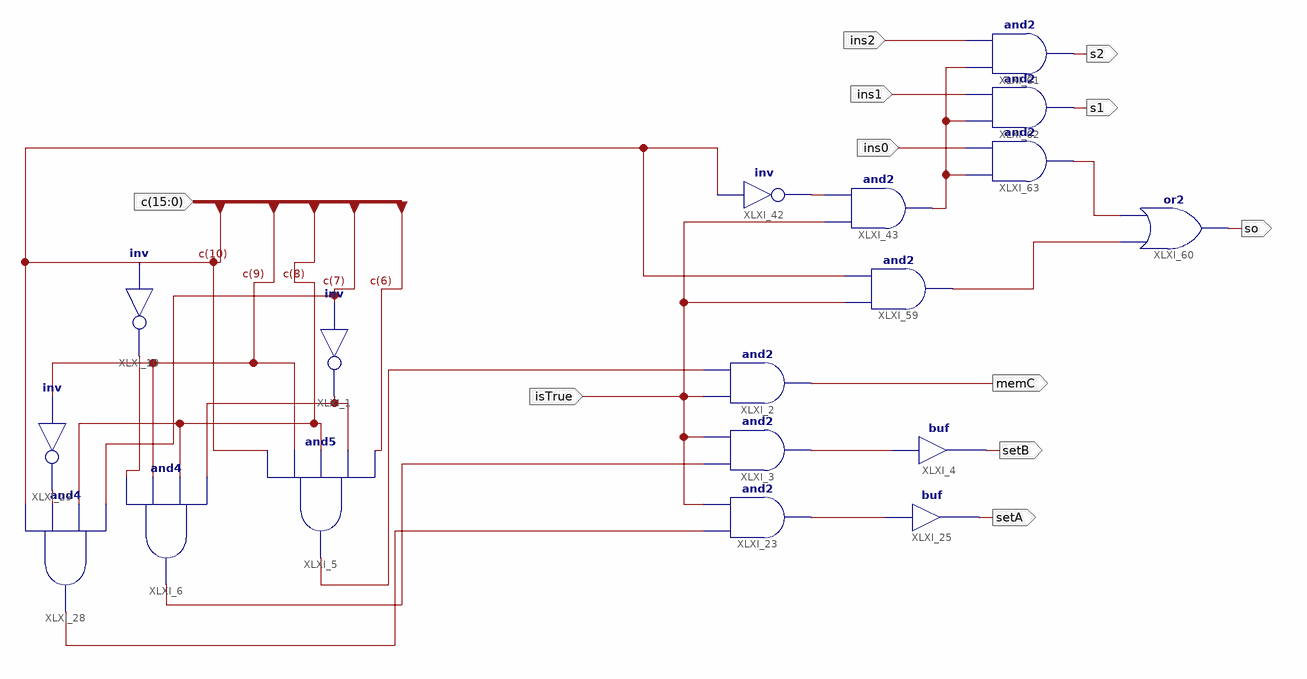
[diagram p0: schematic sheet 1]
// Xilinx ISE schematic ALUR.sch (spartan3e) as structural Verilog: 18 symbols, 11 ports
module ALUR (
  input  isTrue,
  input  [15:0] c,
  input  ins2,
  input  ins1,
  input  ins0,
  output memC,
  output setB,
  output setA,
  output so,
  output s1,
  output s2
);

  wire XLXN_15, XLXN_16, XLXN_27, XLXN_35, XLXN_37, XLXN_61, XLXN_62, XLXN_66, XLXN_92, XLXN_129, XLXN_130,
       XLXN_133;

  not XLXI_1 (XLXN_16, c[7]);
  and XLXI_2 (memC, isTrue, XLXN_15);
  and XLXI_3 (XLXN_27, XLXN_37, isTrue);
  buf XLXI_4 (setB, XLXN_27);
  and XLXI_5 (XLXN_15, c[10], c[9], c[8], XLXN_16, c[6]);
  and XLXI_6 (XLXN_37, XLXN_35, c[9], c[8], XLXN_16);
  and XLXI_23 (XLXN_61, XLXN_66, isTrue);
  buf XLXI_25 (setA, XLXN_61);
  and XLXI_28 (XLXN_66, c[10], XLXN_62, c[8], c[7]);
  not XLXI_29 (XLXN_62, c[9]);
  not XLXI_10 (XLXN_35, c[10]);
  not XLXI_42 (XLXN_92, c[10]);
  and XLXI_43 (XLXN_133, isTrue, XLXN_92);
  and XLXI_59 (XLXN_130, isTrue, c[10]);
  or XLXI_60 (so, XLXN_130, XLXN_129);
  and XLXI_63 (XLXN_129, XLXN_133, ins0);
  and XLXI_62 (s1, XLXN_133, ins1);
  and XLXI_61 (s2, XLXN_133, ins2);
endmodule
